# EAGLE design AmbaSat-07-CCS811 (EAGLE 9.5.1)
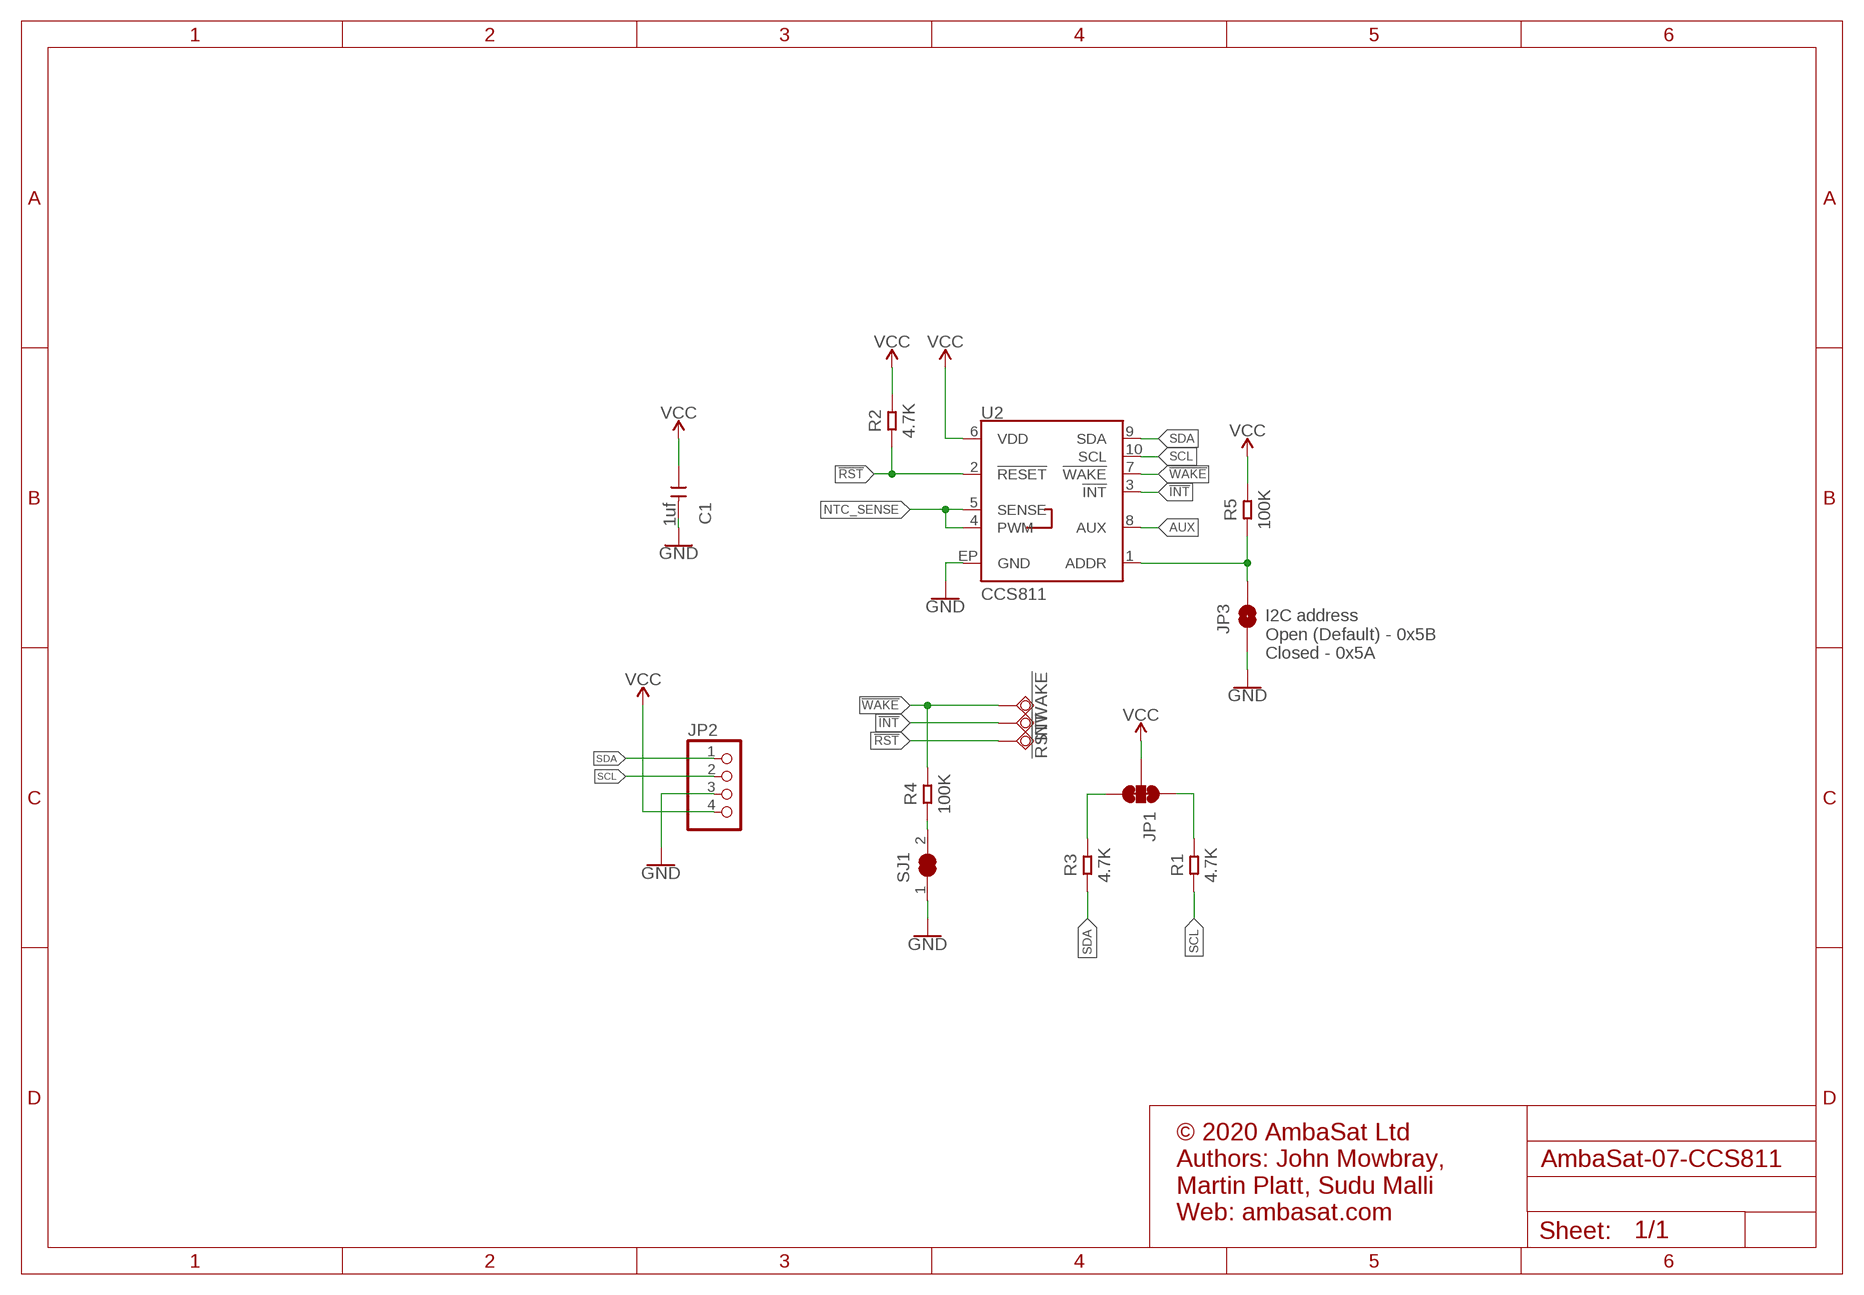
[diagram p0: schematic, sheet 1]

## Parts
!INT  TESTPAD_TPSQTP14SQ  [TESTPAD_TP14SQ]
!RST  TESTPAD_TPSQTP14SQ  [TESTPAD_TP14SQ]
!WAKE  TESTPAD_TPSQTP14SQ  [TESTPAD_TP14SQ]
C1  1uf  CERAMIC-1UF-25V-10%-X7R(0603)  [C0603]
JP1  JUMPER-SMT_3_2-NC_TRACE_SILK  [SMT-JUMPER_3_2-NC_TRACE_SILK]
JP2  HEADER-1X4  [1X04_OVAL]
JP3  JUMPER-SMT_2_NO_SILK  [SMT-JUMPER_2_NO_SILK]
R1  4.7K  SMD-RES-4.7K-5%-1/10W(0603)  [R0603]
R2  4.7K  SMD-RES-4.7K-5%-1/10W(0603)  [R0603]
R3  4.7K  SMD-RES-4.7K-5%-1/10W(0603)  [R0603]
R4  100K  SMD-RES-100K-1%-1/10W(0603)  [R0603]
R5  100K  SMD-RES-100K-1%-1/10W(0603)  [R0603]
SJ1  SOLDERJUMPER_CLOSED  [SOLDERJUMPER_CLOSEDWIRE]
U2  CCS811  [LGA10]

## Nets
3.3V [power]: C1.1 JP1.2 JP2.4 R2.2 R5.2 U2.6(VDD) ; supply symbol labelled VCC
!INT: !INT.TP U2.3(!INT!)
!RST: !RST.TP R2.1 U2.2(!RESET!)
!WAKE: !WAKE.TP R4.2 U2.7(!WAKE!)
AUX: U2.8(AUX)
CCS811_ADDR: JP3.2 R5.1 U2.1(ADDR)
GND [power]: C1.2 JP2.3 JP3.1 SJ1.1 U2.EP(GND)
N$1: R4.1 SJ1.2
N$4: JP1.3 R3.2
N$5: JP1.1 R1.2
NTC_SENSE: U2.4(PWM) U2.5(SENSE)
SCL: JP2.2 R1.1 U2.10(SCL)
SDA: JP2.1 R3.1 U2.9(SDA)

## Notes on the sheet
- I2C address
  Open (Default) - 0x5B
  Closed - 0x5A
- © 2020 AmbaSat Ltd
  Authors: John Mowbray, 
  Martin Platt, Sudu Malli
  Web: ambasat.com

## Library data of the parts
!INT !RST !WAKE = BeagleBone_Blue_R3:TESTPAD_TPSQ: Test pad
C1 = Seeed-Capacitor:CERAMIC-1UF-25V-10%-X7R(0603): 302010139; MPN: CC0603KRX7R8BB105
JP1 = SparkFun-Jumpers:JUMPER-SMT_3_2-NC_TRACE: Normally closed trace jumper (2 of 2 connections) This jumper has a trace between all three pads so they are normally closed (NC). Use a razor knife to open the connection(s). For best results follow the IPC guidelines for cutting traces: Cutout at least 0.063 mm (0.005 in). Remove all loose material to clean up the cut area. Seal the cut with an approved epoxy. Reapply solder to reclose the connection(s).
JP2 = microbuilder:HEADER-1X4: PIN HEADER
JP3 = SparkFun-Jumpers:JUMPER-SMT_2_NO: Normally open jumper This jumper has two pads in close proximity to each other. Apply solder to close the connection. Round pads are easier to solder for beginners, but are a lot larger. SparkFun Product that uses the round pads: SparkFun EL Sequencer <https://www.sparkfun.com/products/12781>
R1-R3 = Seeed-Resistor:SMD-RES-4.7K-5%-1/10W(0603): 301010290; MPN: RC0603JR-074K7L
R4 R5 = Seeed-Resistor:SMD-RES-100K-1%-1/10W(0603): 301010196; MPN: RC0603FR-07100KL
SJ1 = microbuilder:SOLDERJUMPER_CLOSED: Solder Jumper - Closed These solder jumpers are closed by default CLOSEDWIRE - 10 mil trace between pads that can be cut and resoldered later CLOSEDPERM - 63 mil trace between pads for a permanent connection (used to 'bridge' two signals, a shameless hack for Eagle). Can double as a test point as well (no cream layer)
U2 = CCS811_Breakout_Temp:CCS811: AMS CCS811 – I2C Digital Gas Sensor Ultra-Low Power Digital Gas Sensor for Monitoring Indoor Air Quality AMS Product Page <http://ams.com/eng/Products/Environmental-Sensors/Gas-Sensors/CCS811> SparkFun Products:; PROD_ID: IC-13607

## Net classes
1 power: width 0.254 mm, drill 0.33 mm, clearance 0.203 mm

## Board
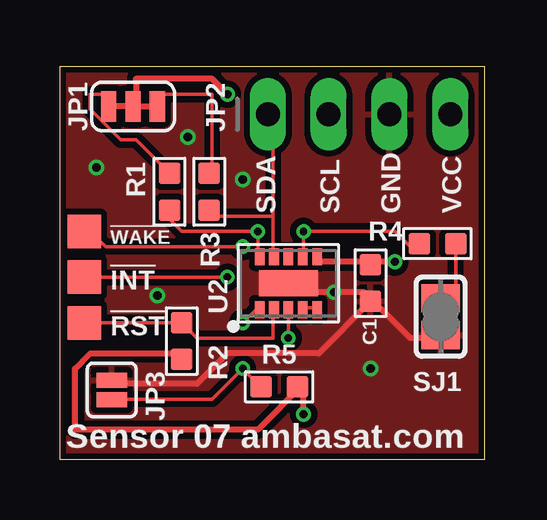
[diagram p1: board, top side]
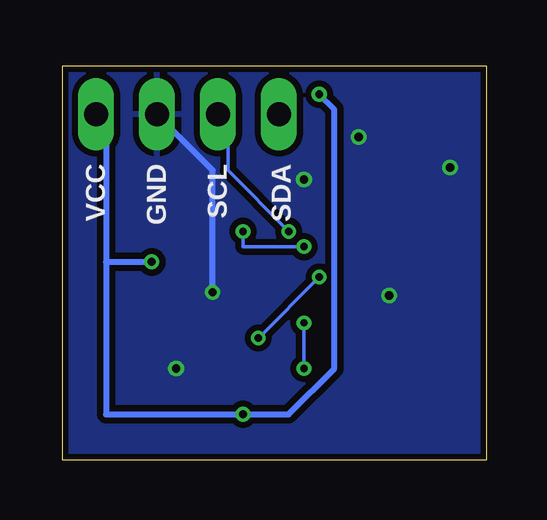
[diagram p2: board, bottom side, seen from below]

Size 17.7 x 16.4 mm. Coordinates in mm from the lower left corner, seen from the top.
Outline: 0,16.4 17.7,16.4 17.7,0 0,0 0,16.4
Copper layers (1*16): Top 0.035mm / dielectric 1.5mm / Bottom 0.035mm
Design rules "SeeedStudio_2layer_DRU_no_angle_20140221": minimum track width 6mil, minimum drill 12mil, track to track 6mil, track to pad 6mil, pad to pad 6mil, via to via 6mil, smd to smd 0mil, copper to edge 10mil, drill to drill 10mil, minimum pad ring 10mil, minimum via ring 6mil, stop-mask expansion 2mil, vias tented up to drill 100mil, thermal gap 10mil

### Footprints (pad centres in the part's own frame; a part is rotated, then mirrored left to right if it is on the bottom)
TESTPAD_TP14SQ = smd 1.4 x 1.4: TP 0,0
C0603 = smd 0.889 x 0.889: 1 0,0.762; 2 0,-0.762
SMT-JUMPER_3_2-NC_TRACE_SILK = smd 0.635 x 1.27: 1 -1.016,0; 2 0,0; 3 1.016,0
1X04_OVAL = drill 1 long: 1 -3.81,0; 2 -1.27,0; 3 1.27,0; 4 3.81,0
SMT-JUMPER_2_NO_SILK = smd 0.635 x 1.27: 1 -0.406,0; 2 0.406,0
R0603 = smd 0.889 x 0.889: 1 0,0.762; 2 0,-0.762
SOLDERJUMPER_CLOSEDWIRE = smd 1.168 x 1.6: 1 -0.762,0; 2 0.762,0 | smd 0.635 x 0.203: WIRE 0,0
LGA10 = smd 0.7 x 0.4: 1 -1.1,1.2; 2 -1.1,0.6; 3 -1.1,0; 4 -1.1,-0.6; 5 -1.1,-1.2; 6 1.1,-1.2; 7 1.1,-0.6; 8 1.1,0; 9 1.1,0.6; 10 1.1,1.2 | smd 1.1 x 2.45: EP 0,0

### Placement (x,y rotation side)
!INT  1.02,7.62 0 top
!RST  1.02,5.71 0 top
!WAKE  1.02,9.53 0 top
C1  12.95,7.37 0 top
JP1  3.05,14.73 0 top
JP2  12.48,14.4 0 top
JP3  2.16,2.92 270 top
R1  4.57,11.18 180 top
R2  5.08,4.95 0 top
R3  6.22,11.18 180 top
R4  15.75,9.02 270 top
R5  9.14,3.05 90 top
SJ1  15.88,5.97 90 top
U2  9.53,7.37 90 top

### Tracks (layer width: path | path; a pad name or v marks a point on that pad's centre or on a via)
3.3V  (via drill 0.33)
  Top 0.254: 10.16,3.17 8.26,1.27 0.64,1.27 0.64,3.81 1.27,4.45 5.08,4.45 R2.2 | U2.6 10.79,8.26 12.7,8.26 C1.1 13.34,8.26 v13.97,8.26 | v6.99,15.24 6.35,15.88 3.17,15.88 3.17,15.24 JP1.2 | v10.16,1.91 10.16,3.17 | 10.16,3.17 R5.2
  Bottom 0.254: v6.99,15.24 6.35,14.61 6.35,3.81 8.26,1.91 v10.16,1.91 15.88,1.91 15.88,8.26 | 15.88,8.26 15.88,13.97 JP2.4 | 15.88,8.26 v13.97,8.26
!INT  (via drill 0.3)
  Top 0.152: v9.53,5.08 U2.3 | !INT.TP v6.99,7.62
  Bottom 0.152: v6.99,7.62 v9.53,5.08
!RST
  Top 0.152: U2.2 8.89,6.35 8.89,5.08 5.71,5.08 R2.1 !RST.TP
!WAKE  (via drill 0.3)
  Top 0.152: U2.7 10.16,8.26 v10.16,9.53 13.97,9.53 14.61,8.89 R4.2 | v7.62,8.89 1.91,8.89 1.27,9.53 !WAKE.TP
  Bottom 0.152: v7.62,8.89 10.16,8.89 v10.16,9.53
CCS811_ADDR  (via drill 0.3)
  Top 0.152: v7.62,5.71 8.26,6.35 U2.1 | R5.1 v7.62,3.81 6.35,2.54 2.54,2.54 JP3.2
  Bottom 0.152: v7.62,3.81 v7.62,5.71
GND  (via drill 0.33, 0.35)
  Top 0.254: C1.2 13.34,6.35 14.61,5.08 15.88,5.08 SJ1.1 | C1.2 10.79,4.45 6.99,4.45 5.71,3.17 2.54,3.17 JP3.1 | U2.EP 9.53,6.99 v11.43,6.99 12.7,6.99 C1.2
  Bottom 0.254: v11.43,6.99 11.43,12.06 13.34,13.97 JP2.3
  other vias: 4.06,6.86 1.52,12.19 12.95,3.81 5.33,13.46 7.62,11.68
  pour Top (isolate 0.254): 0,16.51 17.78,16.51 17.78,0 0,0
  pour Bottom (isolate 0.254): 0,16.51 17.78,16.51 17.78,0 0,0
N$1
  Top 0.152: R4.1 16.51,6.99 15.88,6.99 SJ1.2
N$4
  Top 0.152: R3.2 6.35,12.06 6.35,15.24 3.81,15.24 JP1.3
N$5
  Top 0.152: R1.2 3.17,13.34 2.54,13.34 1.27,14.61 1.27,15.24 1.91,15.24 JP1.1
NTC_SENSE
  Top 0.152: U2.4 10.16,6.35 10.79,6.35 U2.5
SCL  (via drill 0.3)
  Top 0.152: U2.10 8.26,8.26 v8.26,9.53 5.08,9.53 4.45,10.16 R1.1
  Bottom 0.152: v8.26,9.53 10.79,12.06 10.79,13.97 JP2.2
SDA
  Top 0.152: 8.89,10.16 8.89,8.26 U2.9 | 8.89,10.16 6.35,10.16 R3.1 | 8.89,10.16 8.89,13.97 JP2.1

### Text on the board
tPlace: SDA | SCL | GND | VCC | Sensor 07 ambasat.com
bPlace: SDA | SCL | GND | VCC